# EAGLE design ATRIAS_PowerSupply (EAGLE 5.12)
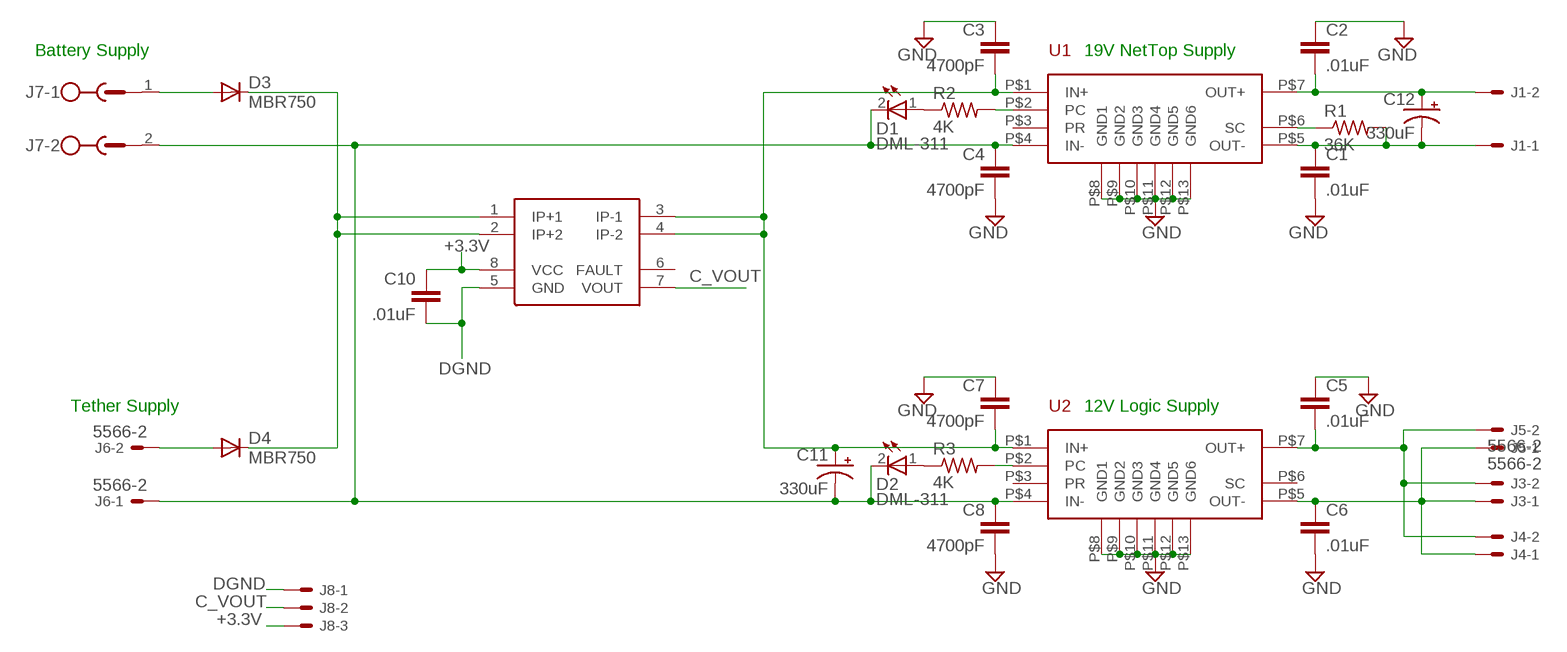
[diagram p0: schematic, sheet 1]

## Parts
C1  .01uF  C-EUC0603  [C0603]
C2  .01uF  C-EUC0603  [C0603]
C3  4700pF  C-EUC0603  [C0603]
C4  4700pF  C-EUC0603  [C0603]
C5  .01uF  C-EUC0603  [C0603]
C6  .01uF  C-EUC0603  [C0603]
C7  4700pF  C-EUC0603  [C0603]
C8  4700pF  C-EUC0603  [C0603]
C10  .01uF  C-EUC0603  [C0603]
C11  330uF  CPOL-US  [TT2D18]
C12  330uF  CPOL-US  [TT2D18]
D1  DML-311  [LED603]
D2  DML-311  [LED603]
D3  MBR750  MUR810  [TO220ACS]
D4  MBR750  MUR810  [TO220ACS]
J1  35362-02  [35362-02]
J3  35362-02  [35362-02]
J4  35362-02  [35362-02]
J5  5566-2  [5566-2]
J6  5566-2  [5566-2]
J7  PTC15-2  [PT15-2]
J8  35362-03  [35362-03]
R1  36K  R-US_R0603  [R0603]
R2  4K  R-US_R0603  [R0603]
R3  4K  R-US_R0603  [R0603]
U1  V48C  [V48C]
U2  V48C  [V48C]
U$1  ACS711  [SOIC8]

## Nets
+3.3V: C10.1 J8.3 U$1.8(VCC)
BIN: D3.A J7.1
C_VOUT: J8.2 U$1.7(VOUT)
DGND: C10.2 J8.1 U$1.5(GND)
GIN: C4.1 C8.1 C11.2(-) D1.2(C) D2.2(C) J6.1 J7.2 U1.P$4(IN-) U2.P$4(IN-)
GND: C1.2 C2.1 C3.1 C4.2 C5.1 C6.2 C7.1 C8.2 U1.P$8(GND1) U1.P$9(GND2) U1.P$10(GND3) U1.P$11(GND4) U1.P$12(GND5) U1.P$13(GND6) U2.P$8(GND1) U2.P$9(GND2) U2.P$10(GND3) U2.P$11(GND4) U2.P$12(GND5) U2.P$13(GND6)
N$1: C2.2 C12.1(+) J1.2 U1.P$7(OUT+)
N$2: C1.1 C12.2(-) J1.1 R1.2 U1.P$5(OUT-)
N$3: R1.1 U1.P$6(SC)
N$4: D4.A J6.2
N$5: R2.2 U1.P$2(PC)
N$6: C5.2 J3.2 J4.2 J5.2 U2.P$7(OUT+)
N$7: C6.1 J3.1 J4.1 J5.1 U2.P$5(OUT-)
N$8: R3.2 U2.P$2(PC)
N$9: D1.1(A) R2.1
N$10: D2.1(A) R3.1
N$11: C3.2 C7.2 C11.1(+) U1.P$1(IN+) U2.P$1(IN+) U$1.3(IP-1) U$1.4(IP-2)
VIN: D3.C D4.C U$1.1(IP+1) U$1.2(IP+2)
Unconnected: U1.P$3(PR) U2.P$3(PR) U2.P$6(SC) U$1.6(FAULT)

## Notes on the sheet
- Battery Supply | 19V NetTop Supply
- Tether Supply | 12V Logic Supply

## Library data of the parts
C1-C8 C10 = rcl:C-EU: CAPACITOR, European symbol
C11 C12 = rcl:CPOL-US: POLARIZED CAPACITOR, American symbol
D1 D2 = rohm:DML-311
D3 D4 = diode:MUR810: DIODE
J1 J3 J4 = con-molex:35362-02
J5 J6 = con-molex:5566-2: Mini FIT connector 2 pol Source: http://www.molex.com; OC_FARNELL: 1822072; OC_NEWARK: unknown
J7 = con-phoenix-500:PTC15-2
J8 = con-molex:35362-03
R1-R3 = resistor:R-US_: RESISTOR, American symbol
U1 U2 = vicor:V48C
U$1 = allegro:ACS711

## Board
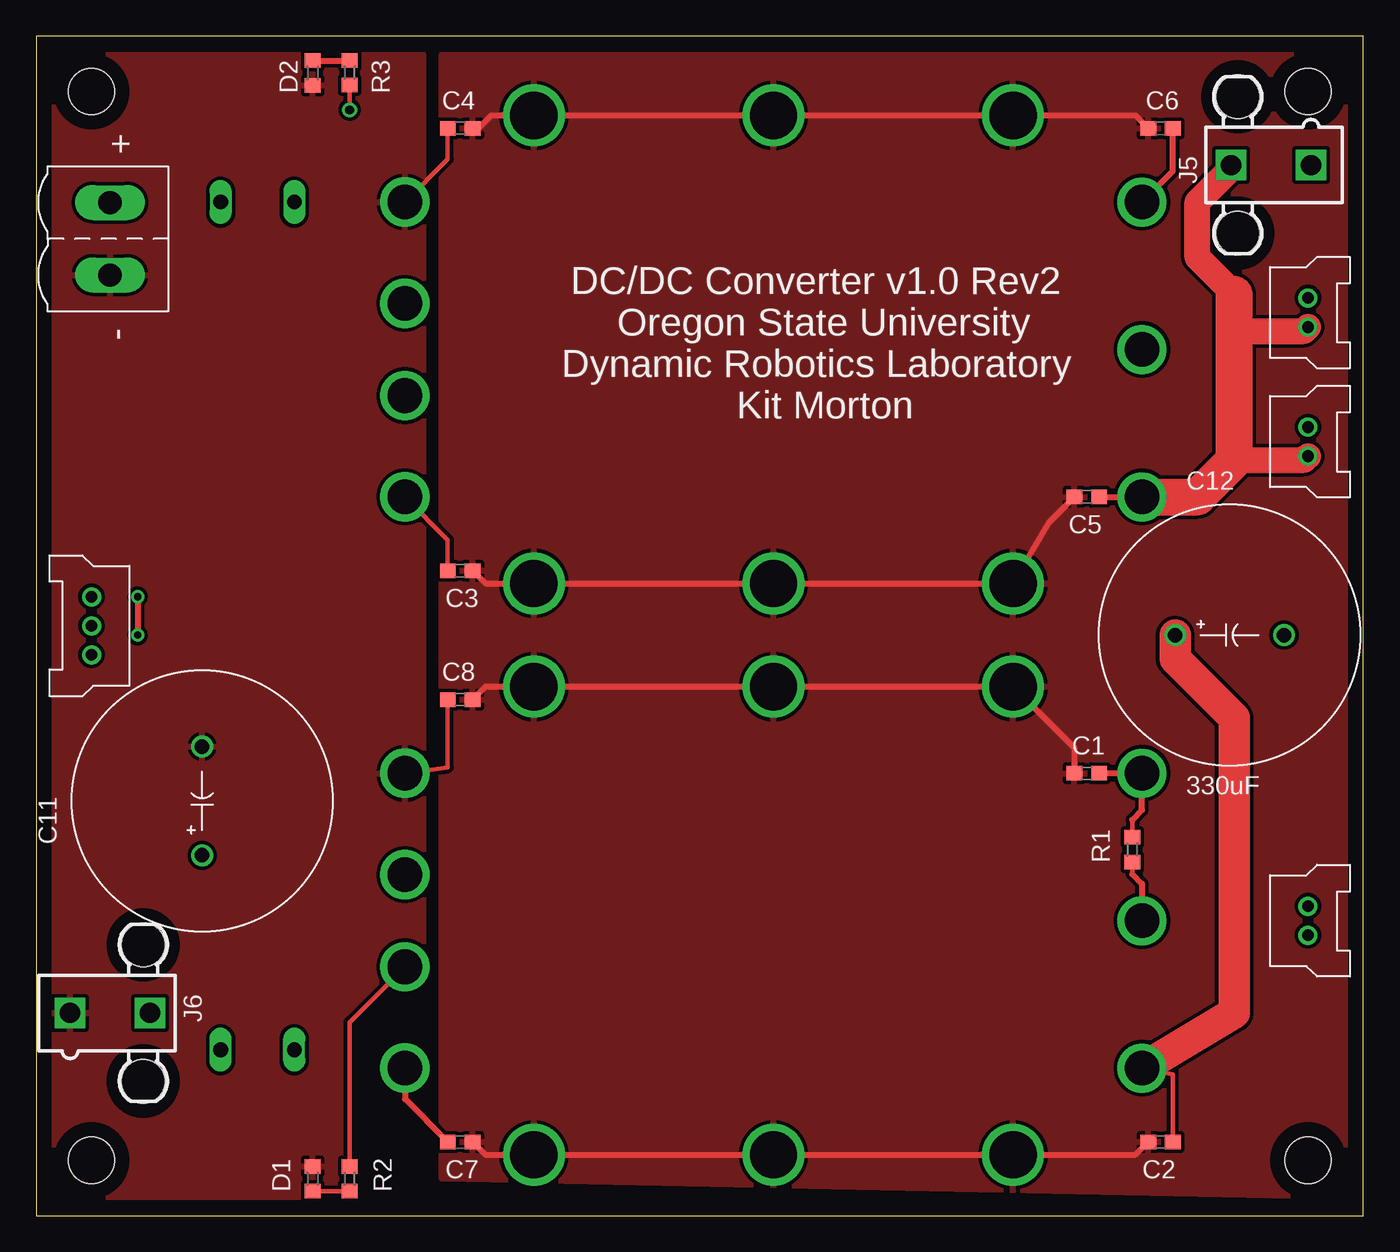
[diagram p1: board, top side]
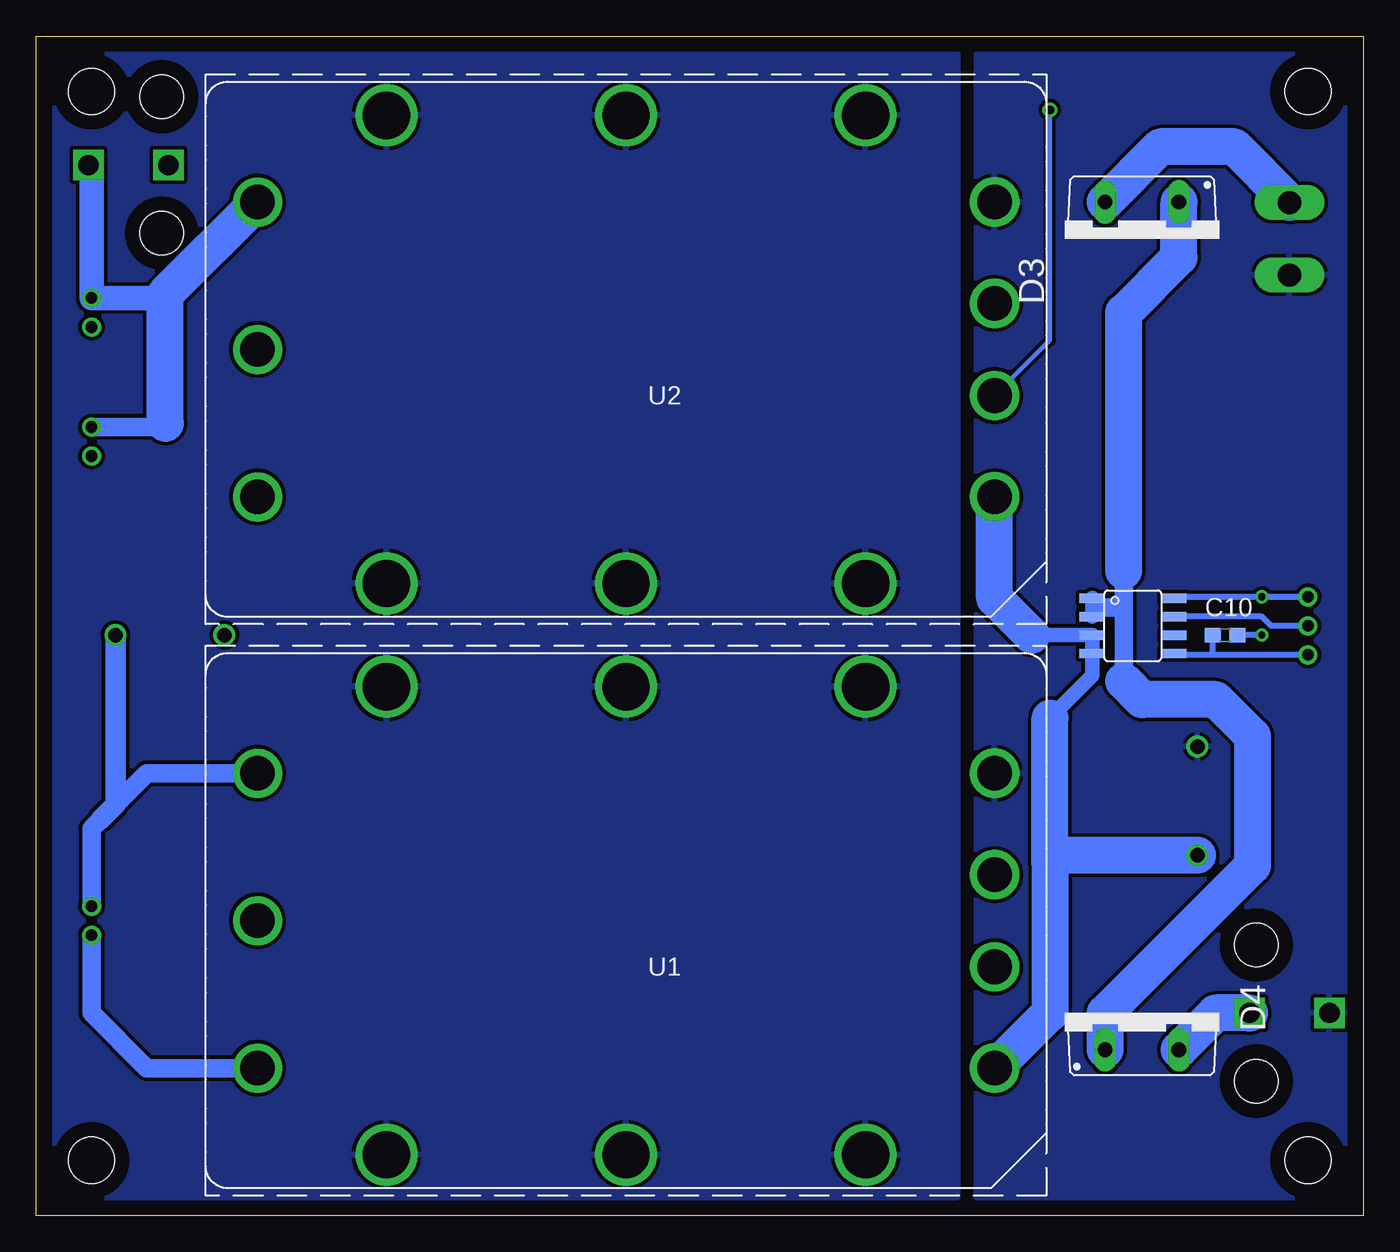
[diagram p2: board, bottom side, seen from below]

Size 91.44 x 81.27 mm. Coordinates in mm from the lower left corner, seen from the top.
Outline: 0,0 91.44,0 91.44,81.27 0,81.27 0,0
Copper layers (1*16): Top 0.035mm / dielectric 1.5mm / Bottom 0.035mm
Design rules "default *": minimum track width 10mil, minimum drill 16mil, track to track 10mil, track to pad 10mil, pad to pad 10mil, via to via 10mil, smd to smd 10mil, copper to edge 40mil, drill to drill 10mil, minimum pad ring 10mil, minimum via ring 8mil, stop-mask expansion 4mil, vias tented up to drill 0mil, thermal gap 10mil
Holes 3.17 mm at 3.81,3.81 3.81,77.47 87.63,77.47 87.63,3.81

### Footprints (pad centres in the part's own frame; a part is rotated, then mirrored left to right if it is on the bottom)
C0603 = smd 1.1 x 1: 1 -0.85,0; 2 0.85,0
TT2D18 = drill 1 round: 1 -3.75,0; 2 3.75,0
LED603 = smd 1 x 1.1: 1 -0.85,0; 2 0.85,0
TO220ACS = drill 1.016 long: A 2.54,-2.54; C -2.54,-2.54
35362-02 = drill 0.8 round: 1 1,0; 2 -1,0
5566-2 = drill 1.4 square: 1 0,-2.75; 2 0,2.75 | hole 3: 4.7,2.29; -4.7,2.29
PT15-2 = drill 1.6 long: 1 -2.5,0; 2 2.5,0
35362-03 = drill 0.8 round: 1 2,0; 2 0,0; 3 -2,0
R0603 = smd 1 x 1.1: 1 -0.85,0; 2 0.85,0
V48C = drill 2.39 round: P$1 0,20.32; P$2 0,13.34; P$3 0,6.99; P$4 0,0 | drill 2.36 round: P$5 50.8,0; P$6 50.8,10.16; P$7 50.8,20.32 | drill 3.26 round: P$8 8.89,-5.97; P$9 25.4,-5.97; P$10 41.91,-5.97; P$11 8.89,26.29; P$12 25.4,26.29; P$13 41.91,26.29
SOIC8 = smd 0.65 x 1.75: 1 -1.905,-2.8; 2 -0.635,-2.8; 3 0.635,-2.8; 4 1.905,-2.8; 5 1.905,2.8; 6 0.635,2.8; 7 -0.635,2.8; 8 -1.905,2.8

### Placement (x,y rotation side)
C1  72.39,30.48 180 top
C2  77.47,5.08 0 top
C3  29.21,44.45 180 top
C4  29.21,74.93 0 top
C5  72.39,49.53 0 top
C6  77.47,74.93 180 top
C7  29.21,5.08 180 top
C8  29.21,35.56 0 top
C10  9.53,40.01 180 bottom
C11  11.43,28.57 90 top
C12  82.23,40.01 0 top
D1  19.05,2.54 90 top
D2  19.05,78.74 270 top
D3  15.24,67.31 180 bottom
D4  15.24,13.97 0 bottom
J1  87.63,20.32 90 top
J3  87.63,62.23 90 top
J4  87.63,53.34 90 top
J5  85.09,72.39 90 top
J6  5.08,13.97 270 top
J7  5.08,67.31 270 top
J8  3.81,40.64 270 top
R1  75.53,25.22 90 top
R2  21.59,2.54 90 top
R3  21.59,78.76 270 top
U1  25.4,30.48 180 bottom
U2  25.4,69.85 180 bottom
U$1  15.88,40.64 270 bottom

### Tracks (layer width: path | path; a pad name or v marks a point on that pad's centre or on a via)
+3.3V  (via drill 0.5)
  Top 0.406: v6.99,42.64 v6.99,40.01
  Bottom 0.406: J8.3 v6.99,42.64 12.98,42.64 U$1.8 | v6.99,40.01 C10.1
BIN
  Bottom 2.54: J7.1 5.08,69.85 8.89,73.66 13.97,73.66 D3.A
C_VOUT
  Bottom 0.406: J8.2 6.35,40.64 6.99,41.27 U$1.7
DGND
  Bottom 0.406: U$1.5 13.07,38.64 10.38,38.64 | 10.38,38.64 C10.2 | J8.1 10.38,38.64
GIN
  Top 0.305: C4.1 28.36,72.81 U2.P$4 | C8.1 28.36,30.9 U1.P$4
  pour Top: 1.27,80.01 26.67,80.01 26.67,1.27 1.27,1.27
  pour Bottom: 1.27,80.01 26.67,80.01 26.67,1.27 1.27,1.27
GND
  Top 0.406: C6.2 75.73,75.82 U2.P$10 U2.P$9 U2.P$8 31.37,75.82 30.48,74.93 C4.2 | C3.1 30.95,43.56 U2.P$11 U2.P$12 U2.P$13 69.85,47.84 C5.1 | C8.2 30.95,36.45 U1.P$8 U1.P$9 U1.P$10 71.54,32.22 C1.2 | C2.1 75.73,4.19 U1.P$13 U1.P$12 U1.P$11 30.95,4.19 C7.1
  pour Bottom: 27.94,80.01 90.17,80.01 90.17,1.27 27.94,1.27
  pour Top: 27.94,80.01 90.17,80.01 90.17,1.27 27.94,2.54
N$1
  Top 0.305: C2.2 78.32,9.74 U1.P$7
  Top 2.184: C12.1 78.48,38.36 82.55,34.29 82.55,13.97 U1.P$7
  Bottom 1.27: U1.P$7 83.82,10.16 87.63,13.97 J1.2
N$2
  Top 0.305: R1.2 75.53,27.27
  Top 0.406: C1.1 U1.P$5 76.2,27.94 75.53,27.27
  Bottom 1.27: U1.P$5 83.82,30.48 87,27.3 87.63,26.67 J1.1
  Bottom 1.422: C12.2 85.98,28.32 87,27.3
N$3
  Top 0.305: R1.1 75.53,23.53
  Top 0.406: 75.53,23.53 76.2,22.86 U1.P$6
N$4
  Bottom 2.54: J6.2 10.16,13.97 D4.A
N$5
  Top 0.305: R2.2 21.59,13.33 U1.P$2
N$6
  Top 0.406: C5.2 U2.P$7
  Top 1.778: 82.55,63.5 80.01,66.04 80.01,69.85 82.34,72.18 J5.2 | J3.2 87.36,60.96 82.55,60.96 | J4.2 87.36,52.07 82.55,52.07
  Top 2.54: U2.P$7 80.01,49.53 82.55,52.07 82.55,60.96 82.55,63.5
N$7
  Top 0.406: U2.P$5 78.32,71.97 C6.1
  Bottom 1.27: J4.1 82.82,54.34 arc-90 82.55,54.61
  Bottom 1.676: J5.1 arc90 87.63,72.18 J3.1 82.82,63.23 arc-90 82.55,63.5
  Bottom 2.54: U2.P$5 82.55,63.5 82.55,54.61
N$8  (via drill 0.6)
  Top 0.305: v21.59,76.2 R3.2
  Bottom 0.305: v21.59,76.2 21.59,60.32 U2.P$2
N$9
  Top 0.305: D1.1 R2.1
N$10
  Top 0.406: D2.1 21.59,79.59 R3.1
N$11
  Top 0.305: C3.2 28.36,46.57 U2.P$1
  Top 0.406: C7.2 25.4,8.04 U1.P$1
  Bottom 1.016: 22.86,40.01 U$1.3 U$1.4 18.68,37.2 21.59,34.29
  Bottom 2.54: 22.86,40.01 25.4,42.55 U2.P$1 | 21.59,24.13 21.59,13.97 U1.P$1 | 21.59,24.13 21.59,34.29 | C11.1 20.89,24.82 21.59,24.13
VIN
  Bottom 1.016: U$1.1 U$1.2 18.04,41.91
  Bottom 1.27: 16.51,36.83 16.51,41.91 | 16.51,41.91 16.51,44.45 | 16.51,41.91 18.04,41.91
  Bottom 2.54: D3.C 12.7,66.04 16.51,62.23 16.51,44.45 | D4.C 17.78,13.97 7.62,24.13 7.62,33.02 10.16,35.56 15.24,35.56 16.51,36.83

### Text on the board
tPlace: + | -
tNames: DC/DC Converter v1.0 Rev2 | Oregon State University | Dynamic Robotics Laboratory | Kit Morton
Measures: 0.7" | 3.6" | .15" | 0.13" dia | 0.125" dia | 0.14" | .15" | 3.2" | 1.33" | 0.16" | .128" dia | 1.5"